# Altium schematic sheet USB.SchDoc
size A4
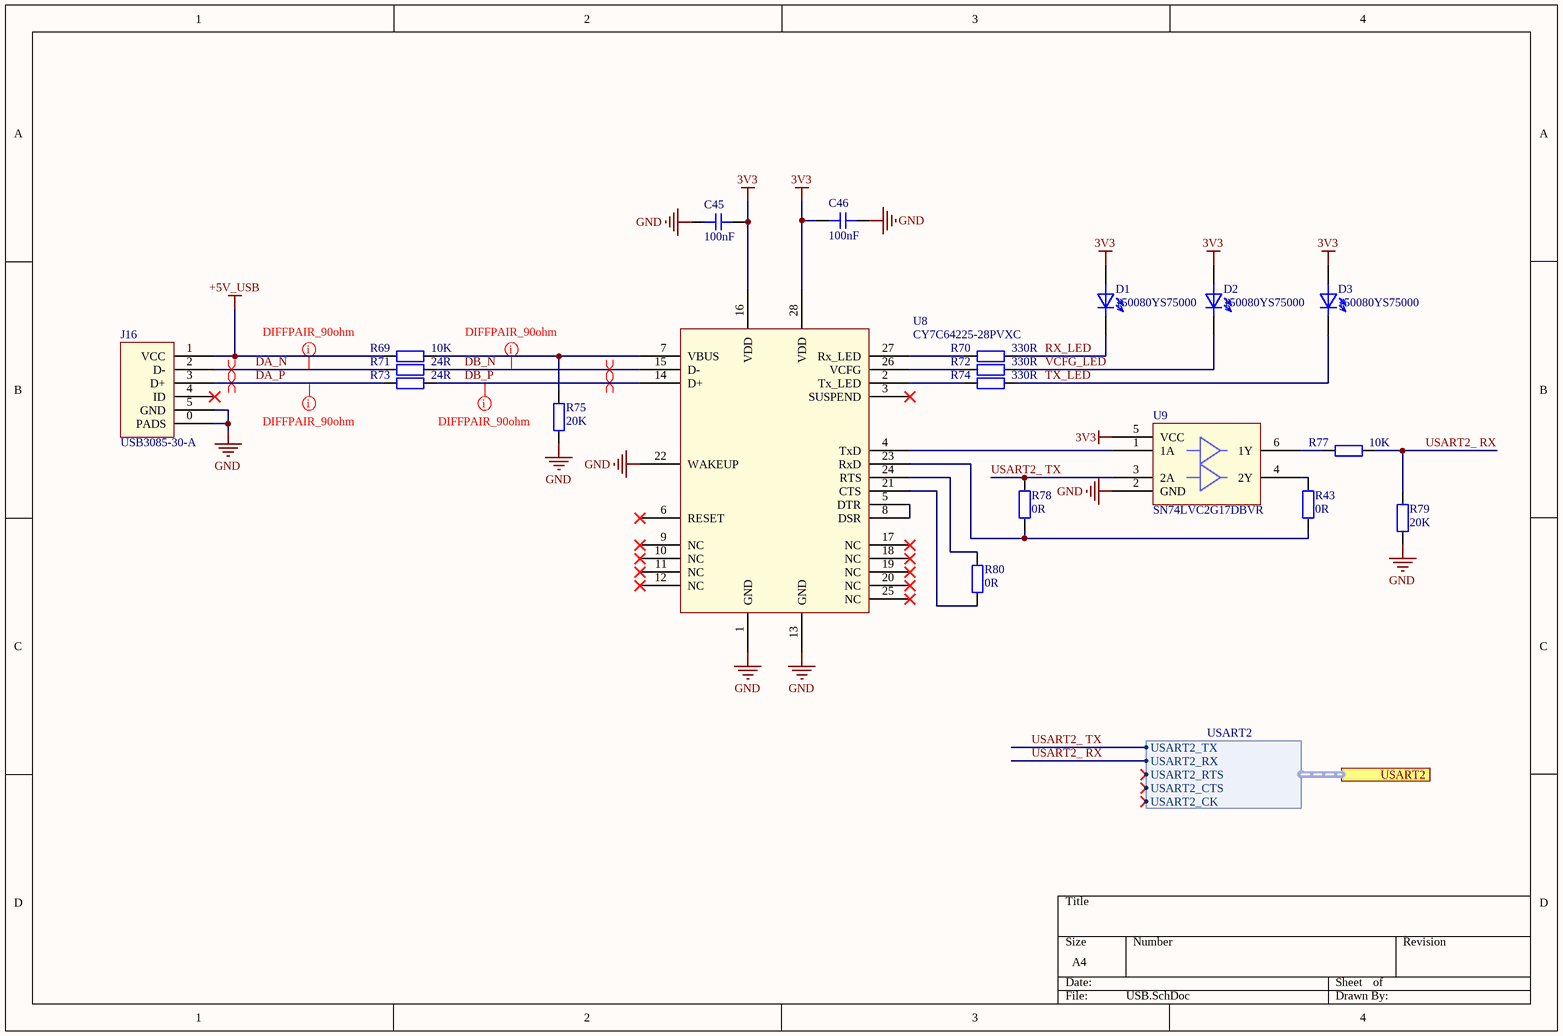
[diagram p0: USB.SchDoc]

## Parts
C45  value 100nF  [Capacitor-0603]  (hidden comment: C-100nF-0603)
C46  value 100nF  [Capacitor-0603]  (hidden comment: C-100nF-0603)
D1  150080YS75000  [150080YS75000]
D2  150080YS75000  [150080YS75000]
D3  150080YS75000  [150080YS75000]
J16  USB3085-30-A  [USB3085-30-A]
R43  value 0R  [Resistor-0603]  (hidden comment: R-0R-0603)
R69  value 10K  [Resistor-0603]  (hidden comment: R-10K-0603)
R70  value 330R  [Resistor-0603]  (hidden comment: R-330R-0603)
R71  value 24R  [Resistor-0603]  (hidden comment: R-24R-0603)
R72  value 330R  [Resistor-0603]  (hidden comment: R-330R-0603)
R73  value 24R  [Resistor-0603]  (hidden comment: R-24R-0603)
R74  value 330R  [Resistor-0603]  (hidden comment: R-330R-0603)
R75  value 20K  [Resistor-0603]  (hidden comment: R-20K-0603)
R77  value 10K  [Resistor-0603]  (hidden comment: R-10K-0603)
R78  value 0R  [Resistor-0603]  (hidden comment: R-0R-0603)
R79  value 20K  [Resistor-0603]  (hidden comment: R-20K-0603)
R80  value 0R  [Resistor-0603]  (hidden comment: R-0R-0603)
U8  CY7C64225-28PVXC  [CY7C64225-28PVXC]
U9  SN74LVC2G17DBVR  [SN74LVC2G17DBVR]

## Ports
USART2 (harness USART2)

## Harnesses
USART2: USART2_TX, USART2_RX, USART2_RTS, USART2_CTS, USART2_CK

## Nets
3V3: C45.1 C46.1 D1.2 D2.2 D3.2 U8.16(VDD) U8.28(VDD) U9.5(VCC)
+5V_USB: J16.1(VCC) R69.1
GND: C45.2 C46.2 J16.0(PADS) J16.5(GND) R75.1 R79.1 U8.1(GND) U8.13(GND) U8.22(WAKEUP) U9.2(GND)
DA_N: J16.2(D-) R71.1
DA_P: J16.3(D+) R73.1
DB_N: R71.2 U8.15(D-)
DB_P: R73.2 U8.14(D+)
RX_LED: D1.1 R70.2
TX_LED: D3.1 R74.2
USART2_ RX: R77.2 R79.2 ; port USART2.USART2_RX
USART2_ TX: R78.2 U9.3(2A) ; port USART2.USART2_TX
VCFG_LED: D2.1 R72.2
NetR43_1: R43.1 R78.1 U8.23(RxD)
NetR43_2: R43.2 U9.4(2Y)
NetR69_2: R69.2 R75.2 U8.7(VBUS)
NetR70_1: R70.1 U8.27(Rx_LED)
NetR72_1: R72.1 U8.26(VCFG)
NetR74_1: R74.1 U8.2(Tx_LED)
NetR77_1: R77.1 U9.6(1Y)
NetR80_1: R80.1 U8.21(CTS)
NetR80_2: R80.2 U8.24(RTS)
NetU8_4: U8.4(TxD) U9.1(1A)
NetU8_5: U8.5(DTR) U8.8(DSR)

Not connected (* = marked no-connect by the designer): J16 4(ID)*; U8 3(SUSPEND)* 6(RESET)* 9(NC)* 10(NC)* 11(NC)* 12(NC)* 17(NC)* 18(NC)* 19(NC)* 20(NC)* 25(NC)*

## Layout directives
differential pair: DA_N, DA_P, DB_N, DB_P
rule Differential Pairs Routing [Pref Gap = 0.2mm    Min Gap  = 0.2mm    Max Gap  = 0.2mmPref Width = 0.4mm    Min Width  = 0.4mm    Max Width  = 0.4mm]: DA_N, DA_P, DB_N, DB_P

## Library data of the parts
C45 C46 = C-100nF-0603: Supplier 1: Digi-Key; Supplier Part Number 1: 1276-1006-1-ND
D1-D3 = 150080YS75000: Supplier 1: Digi-Key; Supplier Part Number 1: 732-4987-1-ND
J16 = USB3085-30-A: Supplier 1: Digi-Key; Supplier Part Number 1: 2073-USB3085-30-ACT-ND
R43 R78 R80 = R-0R-0603: Supplier 1: Digi-Key; Supplier Part Number 1: RMCF0603ZT0R00CT-ND
R69 R77 = R-10K-0603: Supplier 1: Digi-Key; Supplier Part Number 1: 311-10.0KHRCT-ND
R70 R72 R74 = R-330R-0603: Supplier 1: Digi-Key; Supplier Part Number 1: 311-330HRCT-ND
R71 R73 = R-24R-0603: Supplier 1: Digi-Key; Supplier Part Number 1: RMCF0603FT24R0CT-ND
R75 R79 = R-20K-0603: Supplier 1: Digi-Key; Supplier Part Number 1: RMCF0603FT20K0CT-ND
U8 = CY7C64225-28PVXC: Supplier 1: Digi-Key; Supplier Part Number 1: 428-3158-ND
U9 = SN74LVC2G17DBVR: Supplier 1: Digi-Key; Supplier Part Number 1: 296-SN74LVC2G17DBVRDKR-ND